# EasyEDA Pro project ProDoc_Board_ESP_AI_2024-12-05.epro, board PCB_ESP_AI
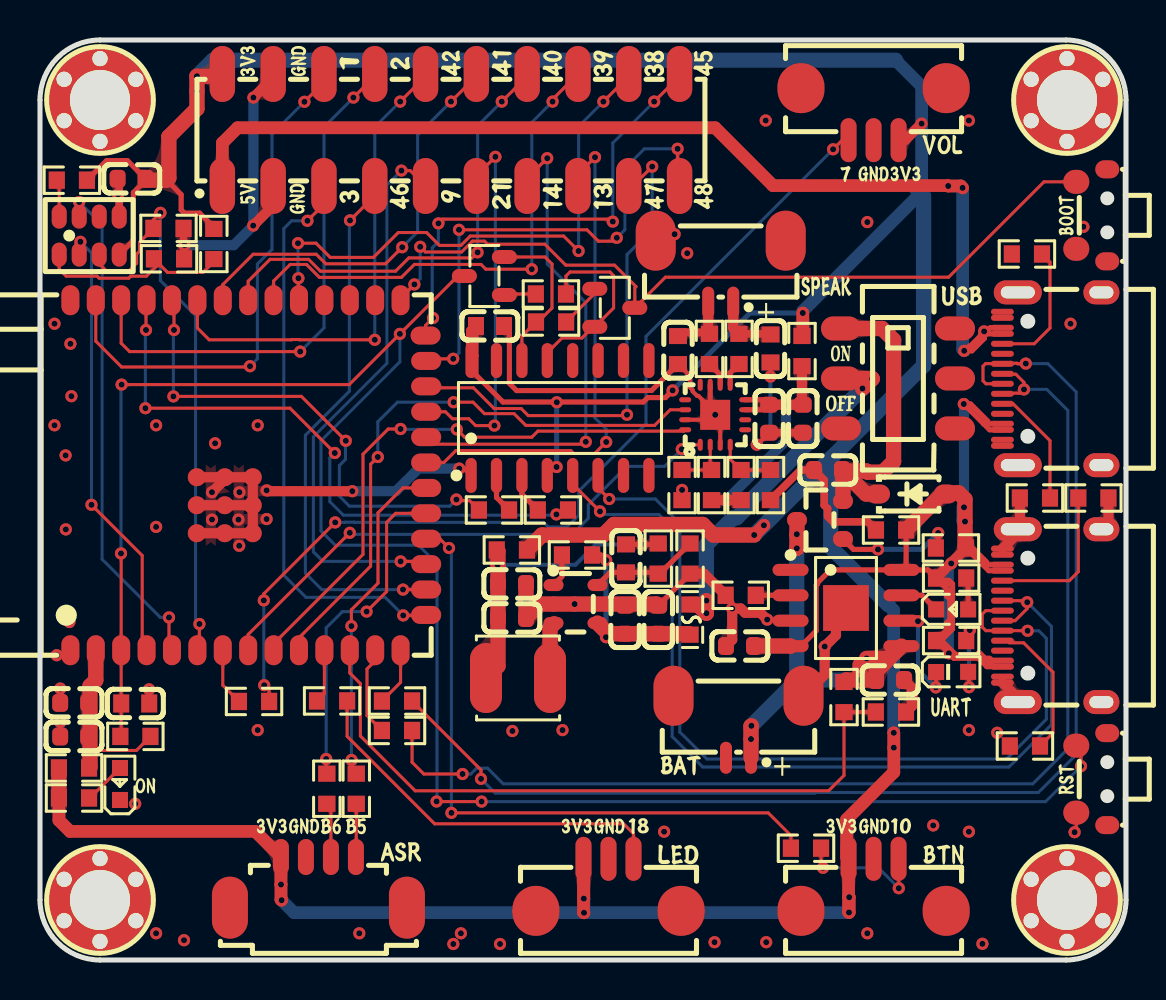
[diagram p4: board, top side]
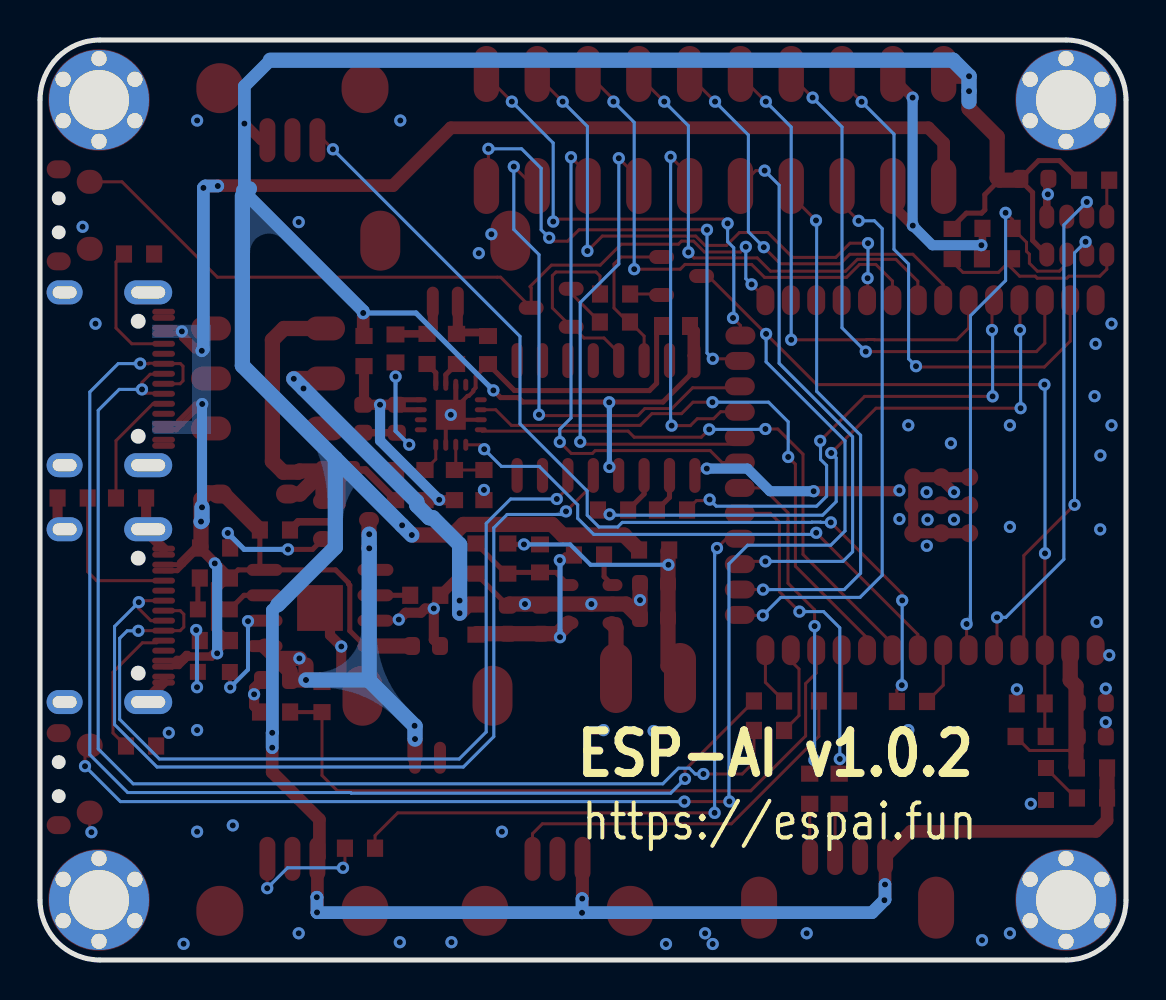
[diagram p5: board, bottom side, seen from below]

Outline 54.3 x 46 mm; copper layers: Top Layer, Bottom Layer. Coordinates in mm from the lower left corner of the outline.
Outline path: 0,43 0,3 arc(0.88,0.88) 3,0 51.3,0 arc(53.42,0.88) 54.3,3 54.3,43 arc(53.42,45.12) 51.3,46 3,46 arc(0.88,45.12) 0,43
Stack: Top Layer 0.035mm / Dielectric1 1.51mm FR4 er 4.5 / Bottom Layer 0.035mm

## Design rules (mm)
template: JLCPCB Capability(Two Layers Board)
spacing copperThickness1oz (default): track to track 0.102, other pairs 0.152 to 0.3
spacing copperThickness2oz: track to track 0.203, other pairs 0.152 to 0.3
track width copperThickness1oz (default): min 0.127, default 0.254, max 2.54
track width copperThickness2oz: min 0.203, default 0.254, max 2.54
differential pair differentialPair (default): width min 0.127, default 0.254, max 2.54; gap min 0.152, default 0.152
via viaSize (default): diameter min 0.5, default 0.61, max 10; hole min 0.3, default 0.305, max 6.3

## Placement (name value [footprint] x y rotation side)
C1  10uF  [C0603]  39.4 24.5 0 top
C2  10uF  [C0603]  29.25 17.01 270 top
C3  100nF  [C0603]  30.91 17.01 270 top
C4  22pF  [C0603_1]  29.3 20.08 90 top
C5  100nF  [C0603]  23.6 18.8 0 top
C6  10uF  [C0603]  23.6 17.1 0 top
C7  10uF  [C0603]  35 15.7 0 top
C8  10uF  [C0603]  42.5 14 180 top
C9  10uF  [C0603]  1.71 12.86 0 top
C10  100nF  [C0603]  1.71 11.18 0 top
C11  1uF  [C0603_1]  4.76 12.83 180 top
C12  100nF  [C0603]  4.58 39.06 180 top
C13  100nF  [C0603_1]  22.5 31.7 0 top
C14  10uF  [C0603]  38.14 27.06 270 top
C15  100nF  [C0603]  36.46 27.06 270 top
C16  220pF  [C0603_1]  36.53 30.58 90 top
C17  220pF  [C0603_1]  31.9 30.5 90 top
CN1  HC-1.25-3PWT  [CONN-SMD_HC-1.25-3PWT]  41.68 42.29 180 top
CN2  HC-1.25-3PWT  [CONN-SMD_HC-1.25-3PWT]  41.68 3.76 0 top
CN3  HC-1.25-3PWT  [CONN-SMD_HC-1.25-3PWT]  28.42 3.76 0 top
D1  B5819W SL  [SOD-123_L2.7-W1.6-LS3.7-RD-1]  43.6 23.3 0 top
F1  JK-SMD0603-100L  [F0603]  32.5 17.02 90 top
FPC1  1.25-4PWB  [CONN-SMD_1.25-4PWB]  13.92 3.88 0 top
HDR1  PZ254-2-10-S  [HDR-SMD_20P-P2.54-V-M-R2-C10-S7.4]  20.55 41.5 0 top
L1  2.2uH  [IND-SMD_L4.0-W4.0]  23.9 14.1 180 top
LED1  KT-0603R  [LED0603-RD]  4 8.8 90 top
LED2  KT-0603R  [LED0603-RD]  45.61 17.53 0 top
M1  -  [M3*5安装孔]  3 3 0 top
M2  -  [M3*5安装孔]  51.35 3 0 top
M3  -  [M3*5安装孔]  3 43 0 top
M4  -  [M3*5安装孔]  51.35 43 0 top
Q1  AO3401A  [SOT-23_L2.9-W1.3-P1.90-LS2.4-BR]  39 22 0 top
Q4  SS8050  [SOT-23-3_L2.9-W1.3-P1.90-LS2.4-BR]  28.74 32.61 180 top
Q5  SS8050  [SOT-23-3_L2.9-W1.3-P1.90-LS2.4-BR]  22.22 34.2 0 top
R1  5.1kΩ  [R0603]  49.75 23.1 0 top
R2  5.1kΩ  [R0603]  49.35 35.3 180 top
R3  100kΩ  [R0603]  45.55 20.6 0 top
R4  100kΩ  [R0603]  42.55 21.5 0 top
R5  5.1kΩ  [R0603]  49.25 10.7 0 top
R6  5.1kΩ  [R0603]  52.67 23.1 0 top
R7  0Ω  [R0603_1]  23.59 20.5 0 top
R8  10kΩ  [R0603_1]  26.85 20.25 180 top
R9  680kΩ  [R0603_1]  30.91 20.07 90 top
R10  5.1kΩ  [R0603]  1.7 8.1 0 top
R11  150kΩ  [R0603_1]  32.5 20.07 90 top
R12  5.1kΩ  [R0603]  45.56 15.97 0 top
R13  5.1kΩ  [R0603]  45.56 19.1 0 top
R14  1kΩ  [R0603]  35.04 18.23 0 top
R15  300kΩ  [R0603]  40.2 13.15 90 top
R16  100kΩ  [R0603]  42.55 12.4 180 top
R17  0Ω  [R0603_1]  1.7 9.6 0 top
R18  10kΩ  [R0603_1]  4.77 11.18 0 top
R19  0Ω  [R0603_1]  17.85 11.48 0 top
R20  0Ω  [R0603_1]  17.85 12.95 0 top
R21  10kΩ  [R0603_1]  25.55 31.9 180 top
R22  0Ω  [R0603_1]  22.7 22.5 180 top
R23  0Ω  [R0603_1]  25.65 22.5 0 top
R24  100kΩ  [R0603]  6.42 36.58 180 top
R25  10kΩ  [R0603_1]  25.55 33.3 0 top
R26  10kΩ  [R0603_1]  1.59 38.99 0 top
R27  10kΩ  [R0603_1]  8.69 35.8 90 top
R28  10kΩ  [R0603_1]  6.45 35.06 0 top
R29  10kΩ  [R0603_1]  36.52 23.75 90 top
R30  10kΩ  [R0603_1]  35.05 23.75 90 top
R31  10kΩ  [R0603_1]  32.1 23.75 90 top
R32  10kΩ  [R0603_1]  33.58 23.75 90 top
R33  0Ω  [R0603_1]  38.1 30.45 270 top
R34  0Ω  [R0603_1]  33.47 30.55 90 top
R35  0Ω  [R0603_1]  34.95 30.55 90 top
R36  0Ω  [R0603_1]  14.34 8.56 90 top
R37  0Ω  [R0603_1]  15.81 8.56 90 top
R38  0Ω  [R0603_1]  10.7 12.93 180 top
R39  0Ω  [R0603_1]  38.3 5.59 180 top
R40  0Ω  [R0603_1]  14.6 12.95 180 top
SW1  MST22D18G2 125  [SW-SMD_MST22D18G2]  42.9 29.08 270 top
SW2  TS24CA  [SW-SMD_TS24CA]  52.59 37.23 270 top
SW3  TS24CA  [SW-SMD_TS24CA]  52.59 9.04 270 top
U1  24018-UCAF001-A  [TYPE-C-USB-SMD_CF003]  50.6 29.06 90 top
U2  24018-UCAF001-A  [TYPE-C-USB-SMD_CF003]  50.6 17.22 90 top
U3  ETA3409S2F  [SOT-23-5_L2.9-W1.6-P0.95-LS2.8-BL]  26.6 18.1 0 top
U4  AP5056  [SOP-8_L4.9-W3.9-P1.27-LS6.0-BL-EP]  40.3 17.6 270 top
U5  19-217/GHC-YR1S2/6T  [LED0603-RD_GREEN]  45.61 14.4 0 top
U6  HCZZ0015-2  [CONN-SMD_HCZZ0015-2]  34.92 11.66 180 top
U7  ESP32-S3-WROOM-1-N16R8  [WIRELM-SMD_ESP32-S3-WROOM-1]  10.41 24.24 90 top
U8  CH340C  [SOP-16_L10.0-W3.9-P1.27-LS6.0-BL]  26 27.1 0 top
U9  MSM261S4030H0R  [MIC-SMD_8P-L4.0-W3.0-P1.00-BR]  2.46 36.22 90 top
U10  MAX98357AETE+T  [TQFN-16_L3.0-W3.0-P0.50-BL-EP1.5]  33.76 27.26 0 top
U11  HCZZ0015-2  [CONN-SMD_HCZZ0015-2]  34.04 34.42 180 top

## Footprints (pads in the part's own frame, mm; a bottom-side part is the same pattern mirrored in y, then rotated)
C0603
  rrect 0.8x0.9 smd: 1(-0.7,0) 2(0.7,0)
C0603_1
  rect 0.8x0.9 smd: 1(-0.7,0) 2(0.7,0)
CONN-SMD_1.25-4PWB
  oval 0.8x1.8 smd: 1(-1.875,1.266) 2(-0.625,1.266) 3(0.625,1.266) 4(1.875,1.266)
  oval 1.8x3.1 smd: 5(-4.425,-1.266) 6(4.425,-1.266)
CONN-SMD_HC-1.25-3PWT
  oval 0.8x2.2 smd: 1(-1.25,1.3) 2(0,1.3) 3(1.25,1.3)
  oval 2.35x2.5 smd: 4(-3.63,-1.3) 5(3.63,-1.3)
CONN-SMD_HCZZ0015-2
  oval 0.6x1.6 smd: 1(-0.625,1.55) 2(0.625,1.55)
  oval 2x3 smd: 3(-3.25,-1.55) 4(3.25,-1.55)
F0603
  rect 0.806x0.864 smd: 1(-0.753,0) 2(0.753,0)
HDR-SMD_20P-P2.54-V-M-R2-C10-S7.4
  oval 1.27x2.8 smd: 1(-11.43,-2.8) 2(-11.43,2.8) 3(-8.89,-2.8) 4(-8.89,2.8) 5(-6.35,-2.8) 6(-6.35,2.8) 7(-3.81,-2.8) 8(-3.81,2.8) 9(-1.27,-2.8) 10(-1.27,2.8) 11(1.27,-2.8) 12(1.27,2.8) 13(3.81,-2.8) 14(3.81,2.8) 15(6.35,-2.8) 16(6.35,2.8) 17(8.89,-2.8) 18(8.89,2.8) 19(11.43,-2.8) 20(11.43,2.8)
IND-SMD_L4.0-W4.0
  oval 1.6x3.5 smd: 1(-1.6,0) 2(1.6,0)
LED0603-RD
  rect 0.8x0.8 smd: 1(-0.799,0) 2(0.799,0)
LED0603-RD_GREEN
  rect 0.8x0.8 smd: 1(-0.799,-0.004) 2(0.799,0.004)
M3*5安装孔
  round 0.762 hole 0.762: 1(1.793,1.035) 2(0,2.07) 5(-1.793,1.035) 6(-1.792,-1.035) 8(0,-2.07) 9(1.792,-1.035)
  round 5.08 smd: 3(0,0)
  round 5 smd far side: 4(0,0)
  round 3.2 hole 3: 7(0,0)
MIC-SMD_8P-L4.0-W3.0-P1.00-BR
  oval 1.2x0.75 smd: 1(0.95,-1.5) 2(0.95,-0.5) 3(0.95,0.5) 4(0.95,1.5) 5(-0.95,1.5) 6(-0.95,0.5) 7(-0.95,-0.5) 8(-0.95,-1.5)
R0603
  rect 0.806x0.864 smd: 1(-0.753,0) 2(0.753,0)
R0603_1
  rect 0.806x0.864 smd: 1(-0.753,0) 2(0.753,0)
SOD-123_L2.7-W1.6-LS3.7-RD-1
  oval 1.2x0.95 smd: 1(-1.7,0) 2(1.7,0)
SOP-8_L4.9-W3.9-P1.27-LS6.0-BL-EP
  oval 0.6x1.8 smd: 1(-1.905,-2.772) 2(-0.635,-2.772) 3(0.635,-2.772) 4(1.905,-2.772) 5(1.905,2.772) 6(0.635,2.772) 7(-0.635,2.772) 8(-1.905,2.772)
  rect 2.29x2.29 smd: 9(0,0)
SOP-16_L10.0-W3.9-P1.27-LS6.0-BL
  oval 0.56x1.745 smd: 1(-4.445,-2.873) 2(-3.175,-2.873) 3(-1.905,-2.873) 4(-0.635,-2.873) 5(0.635,-2.873) 6(1.905,-2.873) 7(3.175,-2.873) 8(4.445,-2.873) 9(4.445,2.873) 10(3.175,2.873) 11(1.905,2.873) 12(0.635,2.873) 13(-0.635,2.873) 14(-1.905,2.873) 15(-3.175,2.873) 16(-4.445,2.873)
SOT-23-3_L2.9-W1.3-P1.90-LS2.4-BR
  oval 1.25x0.7 smd: 1(1,-0.95) 2(1,0.95) 3(-1,0)
SOT-23-5_L2.9-W1.6-P0.95-LS2.8-BL
  oval 1x0.6 smd: 1(-0.924,0.647) 2(-0.924,-0.302) 3(-0.924,-1.252) 4(1.276,-1.252) 5(1.276,0.647)
SOT-23_L2.9-W1.3-P1.90-LS2.4-BR
  oval 1x0.8 smd: 1(1.15,-0.95) 2(1.15,0.95) 3(-1.15,0)
SW-SMD_MST22D18G2
  oval 1.2x2 smd: 1(-2.5,2.85) 2(0,2.85) 3(2.5,2.85) 4(-2.5,-2.85) 5(0,-2.85) 6(2.5,-2.85)
SW-SMD_TS24CA
  oval 0.9x1.2 smd: 1(-2.3,0.775) 2(2.3,0.775)
  oval 1.2x1.3 smd: 3(-1.675,-0.775) 4(1.675,-0.775)
TQFN-16_L3.0-W3.0-P0.50-BL-EP1.5
  oval 0.25x0.6 smd: 1(-0.749,-1.5) 2(-0.248,-1.5) 3(0.252,-1.5) 4(0.751,-1.5) 9(0.75,1.5) 10(0.25,1.5) 11(-0.25,1.5) 12(-0.749,1.5)
  oval 0.6x0.25 smd: 5(1.5,-0.748) 6(1.5,-0.248) 7(1.5,0.252) 8(1.5,0.752) 13(-1.5,0.752) 14(-1.5,0.252) 15(-1.5,-0.248) 16(-1.5,-0.748)
  rect 1.5x1.5 smd: 17(0,0)
TYPE-C-USB-SMD_CF003
  oval 1.2x2.4 hole 0.6x1.7: 17(4.32,1.705) 20(-4.32,1.705)
  oval 1.2x1.8 hole 0.6x1.2: 18(4.32,-2.475) 19(-4.32,-2.475)
  oval 0.3x1.14 smd: A1(-3.35,2.474) A4(-2.55,2.471) A5(-1.25,2.475) A6(-0.25,2.475) A7(0.25,2.474) A8(1.25,2.475) A9(2.55,2.475) A12(3.35,2.475) B1(3.05,2.475) B4(2.25,2.475) B5(1.75,2.475) B6(0.75,2.475) B7(-0.75,2.474) B8(-1.75,2.475) B9(-2.25,2.471) B12(-3.05,2.474)
WIRELM-SMD_ESP32-S3-WROOM-1
  oval 1.5x0.9 smd: 1(-8.75,8.895) 2(-8.75,7.625) 3(-8.75,6.355) 4(-8.75,5.085) 5(-8.75,3.815) 6(-8.75,2.545) 7(-8.75,1.275) 8(-8.75,0.005) 9(-8.75,-1.265) 10(-8.75,-2.535) 11(-8.75,-3.805) 12(-8.75,-5.075) 13(-8.75,-6.345) 14(-8.75,-7.615) 27(8.75,-7.615) 28(8.75,-6.345) 29(8.75,-5.075) 30(8.75,-3.805) 31(8.75,-2.535) 32(8.75,-1.265) 33(8.75,0.005) 34(8.75,1.275) 35(8.75,2.545) 36(8.75,3.815) 37(8.75,5.085) 38(8.75,6.355) 39(8.75,7.625) 40(8.75,8.895)
  oval 0.9x1.5 smd: 15(-6.985,-8.895) 16(-5.715,-8.895) 17(-4.445,-8.895) 18(-3.175,-8.895) 19(-1.905,-8.895) 20(-0.635,-8.895) 21(0.635,-8.895) 22(1.905,-8.895) 23(3.175,-8.895) 24(4.445,-8.895) 25(5.715,-8.895) 26(6.985,-8.865)
  oval 0.9x0.9 smd: 41(-2.9,2.575) 41(-2.9,1.175) 41(-2.9,-0.225) 41(-1.5,2.575) 41(-1.5,1.175) 41(-1.5,-0.225) 41(-0.1,2.575) 41(-0.1,1.175) 41(-0.1,-0.225)

## Nets
As in the schematic.

Pads without a net: M1 1 2 3 4 5 6 7 8 9; M2 1 2 3 4 5 6 7 8 9; M3 1 2 3 4 5 6 7 8 9; M4 1 2 3 4 5 6 7 8 9; SW1 1 2 3 6; SW2 1 2; SW3 1 2; U1 A8 B8; U2 A8 B8; U7 28 29 30; U8 7 8 9 10 11 12 15; U9 2; U10 5 6 12 13

## Via types
v1: diameter 0.61, hole 0.305, Top Layer to Bottom Layer, 200 vias

## Routing (per net, layer and track width the routed paths; a pad name or vN(x,y) marks a point on that pad's centre or on a via; arc(x,y) is an arc through that point)
GND: length 108.3
  Top Layer w0.152: SW3.4 51.81,6.47 v1(51.73,6.39)
  Top Layer w0.203: v1(33.76,27.26) 33.51,27.01 U10.15 ; v1(33.76,27.26) 34.01,27.01 U10.3 ; v1(33.76,27.26) 33.76,27.37 32.92,28.21 32.85,28.21 32.63,28.43 32.63,28.5 32.52,28.61 32.52,29.18 C17.1 ; v1(36.52,29.17) 36.53,29.18 C16.1 ; C15.2 35.86,25.76 v1(35.84,25.76) ; U8.1 21.21,24.57 v1(20.96,24.57) ; U4.3 37.47,17.02 v1(36.36,17.02) ; R14.1 34.61,17.91 v1(34.61,17.57)
  Top Layer w0.254: R11.1 32.5,19.31 C3.1 ; U2.A12 48.12,20.33 48.15,20.3 ; C13.2 23.47,31.43 23.47,28.83 23.83,28.47 30.23,28.47 30.24,28.48 30.58,28.48 C17.1 ; U10.11 33.51,27.62
  Top Layer w0.381: R28.2 7.18,35.09 R24.1 ; C12.2 3.96,38.98 U9.1 ; R4.1 41.39,21.91 39.65,21.91 39.38,22.18 39.38,22.57 39.21,22.74 39.21,23.99 C1.1 38.03,24.5 36.52,22.99 ; 38.14,26.36 C15.2
  Top Layer w0.508: R11.1 33.2,19.32 R14.1 ; U2.20 48.89,13.1 U2.A1 ; R6.2 53.42,21.89 U2.18 ; 39.8,17.1 39.8,16.24 v1(39.23,15.67) 39.23,14.27 38.38,13.41 ; 34.3,15.7 34.61,16.01 v1(34.61,17.57) 35.04,17.57 35.25,17.36 36.02,17.36 v1(36.36,17.02) ; v1(10.66,36.72) 11.66,37.72 HDR1.3 ; U7.41 9.24,24.03 v1(8.6,23.39) ; U7.41 U7.41 U7.41 ; U7.41 U7.41 ; v1(15.62,23.44) 11.37,23.44 v1(11.33,23.48) ; U7.41 U7.41 U7.41 U7.41 ; U7.41 U7.41 U7.41 ; C8.1 43.6,13.6 v1(43.6,13.28) 43.6,12.7 R16.1 ; HDR1.4 11.66,44.11 v1(10.67,43.12) ; U2.A12 48.89,21.34 U2.17 48.99,21.64 R1.1
  Top Layer w0.762: C5.2 v1(24.3,17.99) C6.2 25,17.8 U3.2 v1(26.73,17.8) v1(30.05,17.8) 30.83,17.8 C3.1 ; U6.3 38.38,13.41
  Bottom Layer w0.203: v1(35.84,25.76) 36.52,26.45 v1(36.52,29.17)
  Bottom Layer w0.508: v1(15.62,23.44) 17.8,23.44 18.93,24.57 v1(20.96,24.57) ; v1(10.67,43.12) 10.67,36.73 v1(10.66,36.72) 9.68,35.74 v1(7.23,35.74)
  vias: v1(0.73,31.81) v1(0.73,26.73) v1(0.84,15.24) v1(1.01,13.57) v1(1.01,11.89) v1(1.28,25.23) v1(1.29,21.53) v1(1.52,30.81) v1(1.47,16.9) v1(1.57,28.19) v1(3.91,38.28) v1(4.76,7.81) v1(5.46,13.53) v1(5.8,26.73) v1(5.8,21.66) v1(5.8,1.34) v1(7.2,0.99) v1(8.6,22.02) v1(8.76,25.84) v1(9.92,22.02) v1(9.97,23.39) v1(9.96,20.71) v1(10.89,26.73) v1(10.89,11.5) v1(11.33,22.05) v1(15.97,1.34) v1(20.67,0.8) v1(21.05,1.34) v1(23,0.8) v1(23.62,11.45) v1(26.13,11.5) v1(31.2,6.42) v1(31.73,36.29) v1(32.1,23.5) v1(32.36,35.34) v1(33.73,0.89) v1(36.29,41.98) v1(36.31,0.89) v1(41.36,36.9) v1(41.36,1.34) v1(44.66,6.73) v1(46.45,41.98) v1(46.45,11.5) v1(46.45,6.42) v1(47.12,0.81) v1(47.86,11.36) v1(51.52,31.81) v1(52.17,36.66)
VBAT: length 23
  Top Layer w0.762: 37.85,21.3 37.85,20.59 v1(37.84,20.58) ; 37.85,21.3 Q1.3 ; 37.85,21.3 v1(37.84,21.29) ; U6.1 v1(35.55,11.05) 35.55,11.69 v1(35.57,11.71) ; 41,14.75 v1(41,14) ; v1(41,14) 41.8,14 41.8,14.42 U4.5 ; v1(41,14) 40.3,14 R15.2 ; 42.32,15.08 v1(41.33,15.08)
  Bottom Layer w0.762: 37.84,13.98 v1(37.84,20.58) v1(37.84,21.29) ; 37.84,13.98 v1(35.57,11.71) 35.55,11.69 v1(35.55,11.05) ; 37.84,13.98 37.86,14 v1(41,14)
VCC_3V3: length 213.9
  Top Layer w0.254: 6.33,38.99 7.06,38.27 7.06,37.51 7.22,37.34 7.98,37.34 8.69,36.64 R27.2 ; 21.8,30.22 21.8,29.25 23.15,27.9 25.85,27.9 ; 21.8,30.22 21.8,31.7 ; 21.8,30.22 U8.16 ; 25.85,27.9 v1(25.84,27.89) ; 25.85,27.9 30.16,27.9 30.38,28.12 31.27,28.12 v1(31.63,28.48) ; 2.35,38.99 3.33,39.97 4.37,39.97 5.28,39.06 5.28,39 5.29,38.99 4.67,38.38 4.67,35.98 U9.8
  Top Layer w0.508: CN1.1 43.25,40.99 v1(44.08,41.82) ; 21.8,31.7 21.55,31.45 U8.16
  Top Layer w0.635: R33.1 38.14,31.24 v1(38.14,32.35) ; 40.43,3.17 CN2.1 40.33,5.16 40.33,7.03 42.69,9.39 v1(42.69,10.62) v1(42.69,11.36) ; 40.43,3.17 40.43,2.4 v1(40.45,2.38) 40.46,2.39 v1(40.46,3.14) 40.43,3.17 ; v1(27.2,2.36) 27.17,2.39 CN3.1 27.19,5.04 v1(27.19,3.07) ; v1(12.08,2.99) 12.05,3.02 v1(12.05,3.78) 12.05,3.78 12.05,5.15 10.77,6.43 1.5,6.43 0.95,6.98 R10.1 ; v1(35.71,21.25) v1(36.2,21.73)
  Top Layer w0.762: 5.29,38.99 6.33,38.99 6.44,39.1 6.44,41.16 7.85,42.57 v1(7.85,43.44) v1(7.85,44.19) 9.01,44.19 HDR1.2 ; v1(35.71,21.25) 33.67,21.25 33.14,21.78 28.69,21.78 28.17,21.25 25.09,21.25 24.35,20.5 ; R17.1 R10.1
  Bottom Layer w0.254: v1(25.83,24.65) 25.83,27.88 v1(25.84,27.89) ; v1(31.63,28.48) 35.5,32.35 v1(38.14,32.35)
  Bottom Layer w0.635: 27.2,2.37 40.44,2.37 v1(40.45,2.38) 40.45,3.13 v1(40.46,3.14) ; 27.2,2.37 12.7,2.37 v1(12.08,2.99) 12.05,3.02 v1(12.05,3.78) ; 27.2,2.37 v1(27.2,2.36) ; 27.2,2.37 27.2,3.06 v1(27.19,3.07) ; 44.04,38.35 38.14,32.45 v1(38.14,32.35) ; 42.41,17.76 42.68,17.49 42.68,11.37 v1(42.69,11.36) v1(42.69,10.62) ; 42.78,44.99 44.08,43.69 v1(44.08,41.82) 44.08,38.59 44.18,38.49
  Bottom Layer w0.762: 42.78,44.99 8.65,44.99 v1(7.85,44.19) v1(7.85,43.44) 7.85,42.92 ; v1(35.71,21.25) v1(36.2,21.73) 39.53,25.07 ; 39.53,25.07 39.53,20.64 42.41,17.76 ; 39.53,25.07 44.18,29.72 44.18,38.21 ; 43.83,38.56 44.04,38.35
VCC_BOARD: length 19.1
  Top Layer w0.762: v1(41.13,28.58) v1(41.61,29.06) 41.59,29.08 SW1.5 ; F1.2 32.89,17.78 v1(33.32,17.34) v1(33.32,17.97)
  Bottom Layer w0.762: v1(41.61,29.06) v1(41.13,28.58) 35.46,22.91 35.46,22.73 34.84,22.11 34.66,22.11 33.32,20.77 v1(33.32,17.97) v1(33.32,17.34)
ASR_PB5: length 2.7
  Top Layer w0.152: 15.8,5.15 15.81,5.17 R37.1
ASR_PB6: length 2.7
  Top Layer w0.152: R36.1 14.55,7.6 14.55,5.15
AUX_VCC: length 15.5
  Top Layer w0.762: 40.15,24.45 41.32,24.45 41.38,24.39 42.14,24.39 42.68,24.93 42.68,31 42.1,31.58 SW1.4 ; 40.15,24.45 C1.2 ; 40.15,24.45 Q1.2 ; 40.15,24.45 41.3,23.3 D1.1
BAT_CHRG: length 2
  Top Layer w0.254: U4.7 44.1,18.23 LED2.1
BAT_STBY: length 5.3
  Top Layer w0.203: v1(43.9,16.94) 43.88,16.97 U4.6 ; U5.1 44.81,13.65 v1(44.79,13.63)
  Bottom Layer w0.203: v1(44.79,13.63) 43.9,14.52 v1(43.9,16.94)
DTR: length 9.7
  Top Layer w0.152: R25.2 26.3,34.2 26.5,34.4 28.5,34.4 28.68,34.22 28.68,32.6 Q4.2 27.66,31.66 27.1,31.1 26.1,31.1 25.36,30.37 U8.13
EN_RST: length 101
  Top Layer w0.152: v1(22.08,7.92) 19.94,7.92 19.83,8.03 ; v1(52.05,9.69) 52.05,10.48 51.81,10.72 ; Q5.3 20.89,34.2 v1(18,31.31) 15.46,28.77 v1(4.08,28.77) ; v1(4.05,20.33) 4.06,20.32 U7.3 4.06,11.22 R18.1
  Bottom Layer w0.152: v1(4.08,28.77) 4.05,28.74 v1(4.05,20.33) ; v1(18,31.31) 18,29.91 14.05,25.96 14.05,21.45 14.76,20.74 18.92,20.74 19.85,19.81 19.85,7.93 ; v1(52.05,9.69) 50.28,7.92 v1(22.08,7.92)
  vias: v1(19.83,7.93)
GAIN_CTRL: length 2.8
  Top Layer w0.152: U10.2 33.51,24.57 R32.2 R31.2
IO0_BOOT: length 40.9
  Top Layer w0.152: v1(18.72,33.78) 18.03,33.09 U7.27 ; SW2.3 50.2,38.91 45.43,34.14 31.27,34.14 Q4.3 29.74,33.61 29.8,33.67 28.73,34.74 26.29,34.74 25.24,35.79 22.38,35.79 22.23,35.94 21.62,35.94 21.08,35.4 19.27,35.4 v1(19.01,35.66)
  Bottom Layer w0.152: v1(19.01,35.66) 19.01,34.07 v1(18.72,33.78)
IO1_EXD: length 26.5
  Top Layer w0.152: U7.39 2.79,30.94 4.08,29.65 10.46,29.65 v1(10.5,29.69) ; v1(13.22,42.91) 14.2,43.89 HDR1.6
  Bottom Layer w0.152: v1(13.22,42.91) 11.6,41.29 11.6,35.53 10.87,34.8 10.87,30.06 v1(10.5,29.69)
IO2_EXD: length 26.7
  Top Layer w0.152: v1(15.67,43.12) 16.74,44.19 HDR1.8 ; U7.38 4.06,30.84 4.48,30.42 v1(13.01,30.42)
  Bottom Layer w0.152: v1(13.01,30.42) 14.2,31.61 14.2,41.65 v1(15.67,43.12)
IO3_EXD: length 28.7
  Top Layer w0.152: v1(13.37,36.96) 14.2,37.79 HDR1.5 ; v1(18.16,17.23) 19.29,17.23 U7.15
  Bottom Layer w0.152: v1(18.16,17.23) 17.26,18.13 13.3,18.13 12.19,19.24 12.19,36.57 12.58,36.96 v1(13.37,36.96)
IO4_SCK: length 22.5
  Top Layer w0.152: U7.4 5.11,15.71 5.11,20.22 v1(2.57,22.76) ; v1(2.02,35.91) 2.02,35.33 U9.6
  Bottom Layer w0.152: v1(2.57,22.76) 2.57,35.36 v1(2.02,35.91)
IO5_WS: length 25.3
  Top Layer w0.152: U7.5 6.45,15.64 v1(6.45,17.13)
  Top Layer w0.254: U9.3 v1(1.96,37.9)
  Bottom Layer w0.152: v1(1.96,37.9) 3.11,36.75 3.11,20.03 6.01,17.13 v1(6.45,17.13)
IO6_SD: length 28.4
  Top Layer w0.152: U9.7 2.96,34.81 3.33,34.44 4.43,34.44 4.83,34.84 4.83,35.29 4.98,35.44 4.98,35.89 R24.2 5.67,37.01 v1(6.02,37.36) ; U7.6 7.97,15.59 v1(7.97,16.8)
  Bottom Layer w0.152: v1(7.97,16.8) 7.78,16.99 7.78,32.21 6.02,33.97 v1(6.02,37.36)
IO7_KNOB: length 2.9
  Top Layer w0.152: U7.7 9.14,13.74 R38.2
IO8_BAT_ADC: length 34.9
  Top Layer w0.152: U7.12 15.49,14.35 16.02,13.82 16.02,11.2 18.76,8.46 39.43,8.46 40.2,9.23 40.2,12.39
  Top Layer w0.203: R16.2 41.79,12.39 40.2,12.39
IO9_EXD: length 28.3
  Top Layer w0.152: v1(18.07,39.47) 18.51,39.47 HDR1.9 ; v1(18.03,19.93) 19.17,19.93 U7.17
  Bottom Layer w0.152: v1(18.07,39.47) 17.34,38.74 17.34,29.83 13.67,26.16 13.67,20.41 14.15,19.93 v1(18.03,19.93)
IO10_BTN: length 32.7
  Top Layer w0.152: R39.2 37.55,6.22 36.41,7.36 v1(20.57,7.36) ; U7.18 19.99,21.06 v1(20.45,20.6)
  Bottom Layer w0.152: v1(20.57,7.36) 20.57,20.48 v1(20.45,20.6)
IO11_TX_TW: length 16.7
  Top Layer w0.152: U7.19 17.78,22.33 17.33,21.88 17.33,18.42 v1(16.33,17.42) ; v1(14.31,10.05) 14.31,9.35 R36.2
  Bottom Layer w0.152: v1(14.31,10.05) 14.31,16.61 15.12,17.42 v1(16.33,17.42)
IO12_RX_TW: length 16.6
  Top Layer w0.152: U7.20 18.14,23.6 16.9,22.36 16.9,18.84 15.57,17.51 15.57,16.68 ; R37.2 15.58,9.55 v1(15.58,10)
  Bottom Layer w0.152: v1(15.58,10) 15.57,10.01 v1(15.57,16.7)
IO13_EXD: length 25.8
  Top Layer w0.152: HDR1.15 26.9,39.29 v1(27.75,40.14) ; U7.21 20.19,24.87 20.79,25.47 26.54,25.47 26.68,25.33 27.74,25.33 v1(28.31,25.9)
  Bottom Layer w0.152: v1(27.75,40.14) 27.75,27.1 28.31,26.54 v1(28.31,25.9)
IO14_EXD: length 25
  Top Layer w0.152: v1(25.36,40.09) 24.36,39.09 HDR1.13 ; v1(27.29,25.91) 27.17,25.79 19.66,25.79 U7.22
  Bottom Layer w0.152: v1(27.29,25.91) 27.29,32.87 25.36,34.8 v1(25.36,40.09)
IO15_DIN: length 27.8
  Top Layer w0.152: v1(32.09,25.54) 32.31,25.76 U10.1 ; U7.8 10.41,16.28 v1(15.49,21.36)
  Bottom Layer w0.152: v1(15.49,21.36) 15.57,21.28 26.61,21.28 27.42,22.09 27.42,22.76 29.34,24.68 31.23,24.68 v1(32.09,25.54)
IO16_BCLK: length 28.6
  Top Layer w0.152: v1(20.84,26.53) 21.23,26.14 24.59,26.14 24.89,26.44 32.19,26.44 U10.16 ; v1(18.03,26.55) 17.41,26.55 16.15,25.29 16.15,20.28 11.68,15.81 U7.9
  Bottom Layer w0.152: v1(20.84,26.53) 18.05,26.53 v1(18.03,26.55)
IO17_LR: length 29.6
  Top Layer w0.152: v1(16.89,25.15) 16.53,24.79 16.53,19.69 12.95,16.11 U7.10 ; v1(20.68,27.89) 21.65,27.89 22.22,27.32 23.7,27.32 24.29,26.73 30.73,26.73 31.51,27.51 U10.14
  Bottom Layer w0.152: v1(20.68,27.89) 17.87,27.89 16.89,26.91 v1(16.89,25.15)
IO18_LED: length 2.7
  Top Layer w0.152: R40.2 14.22,13.32 U7.11
IO19_USB_D-: length 58.1
  Top Layer w0.152: R19.2 18.6,9.89 19.19,9.3 v1(21.13,9.3) ; U1.A7 48.39,29.31 48.41,29.29 48.79,29.29 49.2,28.88 v1(49.2,28.53) 49.18,28.53 48.99,28.34 48.39,28.34 48.36,28.31 U1.B7
  Bottom Layer w0.152: v1(21.13,9.3) 21.54,9.3 21.83,9.59 22.38,9.59 23.16,8.81 49.64,8.81 51.39,10.56 51.39,27.48 50.34,28.53 v1(49.2,28.53)
IO20_USB_D+: length 61.4
  Top Layer w0.152: U1.A6 47.3,28.81 47.15,28.96 47.15,29.69 47.28,29.82 48.11,29.82 U1.B6 48.36,29.81 48.39,29.84 48.85,29.84 48.88,29.81 49.28,29.81 v1(49.29,29.82) ; v1(22.05,9.06) 22.05,9.5 R20.2
  Bottom Layer w0.152: v1(22.05,9.06) 22.77,8.34 38.74,8.34 38.77,8.37 49.91,8.37 51.81,10.27 51.81,28.4 50.39,29.82 v1(49.29,29.82)
IO21_EXD: length 19
  Top Layer w0.152: v1(22.72,26.72) 21.78,26.72 21.44,27.06 20.62,27.06 20.27,27.41 U7.23 ; HDR1.11 21.82,39.21 v1(22.77,40.16)
  Bottom Layer w0.152: v1(22.77,40.16) 22.77,26.77 v1(22.72,26.72)
IO38_EXD: length 28.4
  Top Layer w0.152: v1(12.92,34.09) 12.92,33.02 U7.31 ; v1(12.9,35.84) 13.8,35.84 14.51,35.13 16.67,35.13 17.91,36.37 19.33,36.37 19.97,35.73 21.05,35.73 21.51,36.2 26.18,36.2 v1(26.93,35.45) ; v1(28.17,42.92) 29.44,44.19 HDR1.18
  Bottom Layer w0.152: v1(12.92,34.09) 12.9,34.11 v1(12.9,35.84) ; v1(28.17,42.92) 26.93,41.68 v1(26.93,35.45)
IO39_EXD: length 25.6
  Top Layer w0.152: HDR1.16 25.63,43.03 v1(25.63,42.92) ; U7.32 11.68,33.95 12.51,34.78 13.32,34.78 13.97,34.13 18.07,34.13 18.72,34.78 22.05,34.78 22.29,34.54 v1(24.59,34.54)
  Bottom Layer w0.152: v1(25.63,42.92) 24.59,41.88 v1(24.59,34.54)
IO40_EXD: length 23.5
  Top Layer w0.152: U7.33 10.41,33.94 11.5,35.03 13.43,35.03 14.02,34.44 17.77,34.44 18.44,35.1 21.6,35.1 v1(21.88,35.38) ; HDR1.14 24.36,44.19 v1(23.09,42.92)
  Bottom Layer w0.152: v1(23.09,42.92) 21.88,41.71 v1(21.88,35.38)
IO41_EXD: length 21.1
  Top Layer w0.152: U7.34 9.14,33.77 10.66,35.29 13.81,35.29 14.29,34.81 17.28,34.81 v1(18.11,35.64) ; HDR1.12 21.82,44.19 v1(20.55,42.92)
  Bottom Layer w0.152: v1(20.55,42.92) 18.88,41.25 18.88,36.41 v1(18.11,35.64)
IO42_EXD: length 24.9
  Top Layer w0.152: v1(18.01,42.92) 19.28,44.19 HDR1.10 ; 7.87,32.99 7.87,31.6 8.46,31.01 12.58,31.01 12.59,31.02 12.96,31.02 12.98,31.01 v1(16.74,31.01)
  Bottom Layer w0.152: v1(18.01,42.92) 16.74,41.65 v1(16.74,31.01)
IO43_TX: length 30.7
  Top Layer w0.152: v1(25.82,22.28) 26.18,22.28 R23.2 ; U7.37 5.3,32.96 v1(5.3,31.5) ; v1(5.27,27.59) 12.5,27.59 v1(14.74,25.35)
  Bottom Layer w0.152: v1(5.27,27.59) 5.27,31.47 v1(5.3,31.5) ; v1(25.82,22.28) 25.78,22.24 15.17,22.24 14.49,22.92 14.49,25.1 v1(14.74,25.35)
IO44_RX: length 24.8
  Top Layer w0.152: 20.82,22.97 21.48,22.97 R22.2 ; v1(15.29,25.96) 13.07,28.18 v1(6.67,28.18) ; v1(6.7,31.5) 6.7,32.89 U7.36
  Bottom Layer w0.152: v1(6.67,28.18) 6.67,31.47 v1(6.7,31.5) ; v1(20.82,23.02) 20.49,22.69 15.47,22.69 14.97,23.19 14.97,24.73 15.27,25.03 15.27,25.94 v1(15.29,25.96)
IO45_EXD: length 23.5
  Top Layer w0.152: v1(28.64,36.92) 28.52,37.04 20.13,37.04 v1(19.92,36.83) ; U7.26 19.28,31.73 v1(19.65,32.1) ; v1(30.71,42.92) 31.98,44.19 HDR1.20
  Bottom Layer w0.152: v1(19.92,36.83) 19.92,35.92 19.61,35.61 19.61,35.24 19.61,35.23 19.61,32.14 v1(19.65,32.1) ; v1(28.64,36.92) 28.64,40.85 v1(30.71,42.92)
IO46_EXD: length 27.2
  Top Layer w0.152: U7.16 18.15,18.52 v1(18.15,18.52) ; HDR1.7 16.74,38.22 v1(15.5,36.98)
  Bottom Layer w0.152: v1(18.15,18.52) 14.09,18.52 13.27,19.34 13.27,26.24 15.47,28.44 15.47,36.98 15.47,36.98 v1(15.5,36.98)
IO47_EXD: length 25.2
  Top Layer w0.152: HDR1.17 29.64,38.7 v1(30.61,39.67) ; U7.24 19.38,28.61 21.67,28.61 22.71,27.57 24.06,27.57 24.41,27.22 29.31,27.22 v1(29.35,27.26)
  Bottom Layer w0.152: v1(30.61,39.67) 30.61,36.53 29.35,35.27 v1(29.35,27.26)
IO48_EXD: length 24.7
  Top Layer w0.152: v1(20.95,36.51) 27.35,36.51 27.92,35.94 28.67,35.94 v1(28.84,36.11) ; HDR1.19 31.88,38.8 v1(31.88,40.56) ; U7.25 19.42,30.06 v1(20.66,30.06)
  Bottom Layer w0.152: v1(20.95,36.51) 20.95,30.35 v1(20.66,30.06) ; v1(31.88,40.56) 30.22,40.56 29.24,39.58 29.24,36.51 v1(28.84,36.11)
MAX_3V3: length 13.7
  Top Layer w0.254: U10.8 36.21,28.01 36.46,27.76 36.21,27.51 U10.7
  Top Layer w0.508: 35.05,22.99 34.34,22.99 ; 34.34,22.99 33.58,22.99 ; 34.34,22.99 34.34,23 v1(34.34,23.01) ; 36.46,27.76 v1(37.3,27.76) C14.1 38.1,27.8 38.1,29.69
  Bottom Layer w0.508: v1(37.3,27.76) 37.3,25.97 v1(34.34,23.01)
RTS: length 8
  Top Layer w0.152: U8.14 24.1,31.2 R21.2 24.9,31.9 25.6,32.6 25.6,34.8 25.25,35.15 Q5.2
SD_MODE: length 3
  Top Layer w0.152: U10.4 34.51,25.04 R30.2 R29.2
USB_5V: length 116.3
  Top Layer w0.254: R4.2 43.31,19.74 U4.8 ; U1.A4 47.48,26.51 47.18,26.81 ; 45.33,16.5 45.61,16.78 45.61,18.29 45.33,18.57 ; 45.33,16.5 R12.1 ; 45.33,16.5 45.33,16.86 45.49,17.01 45.49,18.05 45.33,18.2 45.33,18.57 ; 44.92,18.98 R13.1 44.4,19.51 U4.8 ; 44.92,18.98 45.1,18.8 ; 44.92,18.98 45.45,18.98 45.63,18.8 ; 45.63,18.8 45.1,18.8 ; 45.63,18.8 45.63,16.55 45.05,15.97 ; 45.05,15.97 45.08,15.97 45.72,15.33 ; 45.05,15.97 R12.1 ; 45.1,18.8 45.33,18.57 ; U2.A4 47.68,14.67 ; 47.68,14.67 47.38,14.97 ; 47.68,14.67 47.34,14.67 47.04,14.97 ; 45.72,15.33 45.79,15.26 46.83,15.26 46.9,15.33 47.01,15.33 47.26,15.09 ; 45.72,15.33 v1(45.44,15.33) ; 47.04,14.97 46.92,15.09 ; 47.04,14.97 47.38,14.97 ; 47.6,14.97 47.38,14.97 ; 47.6,14.97 47.53,15.04 47.52,15.04 47.47,15.09 47.26,15.09 ; 47.6,14.97 U2.B9 ; 47.38,14.97 47.26,15.09 ; 47.26,15.09 46.92,15.09 ; 46.92,15.09 45.69,15.09 v1(45.44,15.33) ; 47.18,26.81 v1(46.19,27.8) 46.53,27.8 47.38,26.95 ; 47.18,26.81 U1.B9 ; U4.8 39.52,19.51 38.88,18.86 38.88,18.8 38.81,18.74 38.81,16.46 38.05,15.7 U4.4 ; 47.13,19.77 47.43,19.47 U2.B4 ; 47.13,19.77 46.47,20.44 ; 47.13,19.77 U2.A9 ; v1(45.44,15.33) R12.1 ; U1.A9 47.51,31.61 47.27,31.37 ; U1.B4 47.21,31.31 47.21,31.07 46.6,30.46 46.24,30.46 46.47,30.7 46.51,30.7 47.03,31.21 47.03,31.25 v1(47.21,31.43) ; 46.63,20.6 47.33,19.9
  Top Layer w0.508: R13.1 46.3,20.59
  Top Layer w0.635: HDR1.1 9.12,40.85 9.88,41.61 33.76,41.61 36.65,38.72 45.39,38.72 v1(45.41,38.7) 46.04,38.7 v1(46.13,38.61)
  Top Layer w0.762: 45.3,23.36 45.93,23.36 46.25,23.04 v1(46.25,21.92) 46.25,20.65 R3.2 ; R4.2 45.11,23.3 D1.2 ; C7.2 37.52,15.7 U4.4
  Bottom Layer w0.508: 45.57,19.82 45.44,19.69 v1(45.44,15.33) ; v1(46.2,22.63) 46.2,27.79 v1(46.19,27.8)
  Bottom Layer w0.635: v1(45.41,38.7) 46.04,38.7 v1(46.13,38.61) 46.13,30.54 v1(46.21,30.46)
  Bottom Layer w0.762: v1(46.2,22.63) 46.2,21.97 v1(46.25,21.92)
  vias: v1(45.56,19.83)
USB_D+: length 46.9
  Top Layer w0.152: U2.B6 49.28,17.97 v1(49.36,17.89) 49.36,17.57 48.76,16.97 U2.A6 ; U8.5 26.64,23.8 v1(28,22.43)
  Bottom Layer w0.152: v1(49.36,17.89) 50.57,16.68 50.57,11.77 48.45,9.65 33.13,9.65 31.61,11.17 31.61,21.61 30.94,22.28 28.2,22.28 28.05,22.43 v1(28,22.43)
USB_D-: length 44.8
  Top Layer w0.152: v1(49.38,16.46) 49.37,16.47 U2.B7 47.29,16.47 47.11,16.65 47.11,17.29 47.29,17.47 U2.A7 ; U8.6 27.91,23.61 v1(28.46,23.05)
  Bottom Layer w0.152: v1(28.46,23.05) 30.77,23.05 31.99,21.83 31.99,11.4 33.34,10.05 48.33,10.05 50.32,12.04 50.32,16.08 49.94,16.46 v1(49.38,16.46)
$1N4709: length 6
  Top Layer w0.152: U1.A5 48.66,27.81 50.5,25.97 R1.2
$1N4722: length 6.6
  Top Layer w0.152: U1.B5 49.71,30.81 50.5,31.6 50.5,34.9 R2.1
$1N5072: length 6.1
  Top Layer w0.254: R3.1 44.91,20.72 v1(44.91,21.35) ; Q1.1 40.67,20.53 v1(41.9,20.53)
  Bottom Layer w0.254: v1(44.91,21.35) 44.09,20.53 v1(41.9,20.53)
$1N5555: length 2.2
  Top Layer w0.152: 2.45,8.1 2.5,8.1 LED1.2
$1N6052: length 16
  Top Layer w0.203: v1(22.88,19.76) 22.84,19.8
  Top Layer w0.254: R9.2 30.87,20.78 v1(30.1,20.78) C4.2
  Top Layer w0.762: L1.2 22.9,14.7 C6.1 C5.1 22.9,20.44 R7.1
  Bottom Layer w0.203: v1(30.1,20.78) 27.79,20.78 26.77,19.76 v1(22.88,19.76)
$1N6054: length 2.8
  Top Layer w0.762: 25.71,16.81 25.5,16.61 L1.1
$1N6055: length 5.5
  Top Layer w0.254: U3.5 28.51,19.38 C4.1 30.85,19.38 R9.1 30.99,19.32 R11.2
$1N6057: length 9.5
  Top Layer w0.254: v1(28.31,19.99) 28.05,20.25 R8.1
  Top Layer w0.762: U3.4 28.41,16.31 C2.2 C3.2 32.45,16.31 F1.1
  Bottom Layer w0.254: v1(28.31,19.99) 28.3,19.98 v1(28.3,16.14)
$1N6058: length 1.7
  Top Layer w0.254: U3.1 26.1,19.17 R8.2
$1N8206: length 4.3
  Top Layer w0.203: R12.2 46.49,16.15 v1(46.49,16.5) ; U5.2 46.45,14.36 v1(46.45,13.64)
  Bottom Layer w0.203: v1(46.45,13.64) 46.45,16.46 v1(46.49,16.5)
$1N8207: length 1.6
  Top Layer w0.254: R13.2 46.41,19 LED2.2
$1N8211: length 1.7
  Top Layer w0.254: R14.2 U4.2
$1N11656: length 7.7
  Top Layer w0.152: U2.B5 51.47,18.97 51.92,19.42 R6.1
$1N11663: length 7.1
  Top Layer w0.152: U2.A5 48.36,15.97 48.47,15.86 49.18,15.86 50.65,14.39 50.65,11.35 R5.2
$2N631: length 9.3
  Top Layer w0.152: 2.5,10.48 4.82,10.48 R18.2
  Top Layer w0.762: 2.45,9.6 2.5,9.65 2.5,13.7 2.79,13.99 U7.2
$2N764: length 2.9
  Top Layer w0.152: R20.1 18.03,13.88 U7.14
$2N769: length 4.5
  Top Layer w0.152: U7.13 16.76,14.96 16.35,14.55 16.35,12.22 R19.1
$3N640: length 2
  Top Layer w0.254: U8.2 22.83,23.13 R22.1
$3N641: length 2.1
  Top Layer w0.254: R23.1 24.1,23.3 U8.3
$3N2290: length 1.3
  Top Layer w0.254: U10.10 34.01,29.26 R34.1
$3N2291: length 1.2
  Top Layer w0.254: R35.1 34.51,29.36 U10.9
$3N2292: length 4.3
  Top Layer w0.254: 33.47,31.31 32.03,31.31 32.02,31.32 ; 33,31.45 32.15,31.45 32.02,31.32 ; C17.2 32.02,31.32
  Top Layer w0.508: U11.2 33.41,31.37 33.47,31.31
$3N2293: length 3.3
  Top Layer w0.381: 34.95,31.31 36.5,31.31 C16.2
  Top Layer w0.508: U11.1 34.66,31.59 34.95,31.31
$3N9618: length 1.9
  Top Layer w0.152: R26.1 0.96,38.87 U9.4
$3N9620: length 9.9
  Top Layer w0.152: U9.5 0.96,34.54 1.31,34.19 2.86,34.19 2.96,34.09 4.44,34.09 4.54,34.19 5.32,34.19 5.77,34.64 5.77,34.99 ; 5.77,34.99 R28.1 ; 5.77,34.99 6.38,34.38 8.15,34.38 8.69,34.92 R27.1
$3N12428: length 2.3
  Top Layer w0.152: R21.1 27.74,33.33 Q4.1
$3N12472: length 1.6
  Top Layer w0.152: R25.1 23.27,33.3 Q5.1
$4N844: length 19.4
  Top Layer w0.152: 15.36,12.95 15.36,11.18 19.73,6.81 29.18,6.81 29.67,6.31 CN3.3
$4N967: length 47.6
  Top Layer w0.152: CN1.3 40.11,40.99 v1(39.66,40.53) ; R38.1 11.46,13.49 v1(11.21,13.74) ; v1(14.76,21.88) 11.19,18.31 v1(11.19,17.98)
  Bottom Layer w0.152: v1(14.76,21.88) 15.26,21.88 15.27,21.89 15.71,21.89 15.72,21.88 25.19,21.88 25.41,21.65 26.35,21.65 26.94,22.24 26.94,23.45 30.3,26.81 30.3,31.18 v1(39.66,40.53) ; v1(11.21,13.74) 11.19,13.76 v1(11.19,17.98)
$4N1500: length 6.7
  Top Layer w0.152: R39.1 39.05,4.71 v1(39.15,4.61) ; CN2.3 42.94,5.05 v1(42.94,3.59)
  Bottom Layer w0.152: v1(39.15,4.61) 41.92,4.61 v1(42.94,3.59)

## Copper pours and planes (outline as drawn; the poured copper is in the pictures)
GND on Top Layer: -7.5,48.6 57.5,48.6 57.5,-3.1 -7.5,-3.1
GND on Bottom Layer: -9.6,49.9 59.7,49.9 59.7,-4.7 -9.6,-4.7
USB_5V on Bottom Layer: 45.75,31.76 48.7,31.76 48.7,26.3 45.75,26.3

Small or netless copper shapes (teardrops, artwork), in the pictures only: 465 on Top Layer, 116 on Bottom Layer

## Text on the board
Bottom Silkscreen Layer: https://espai.fun | ESP-AI v1.0.2
Top Silkscreen Layer: +
